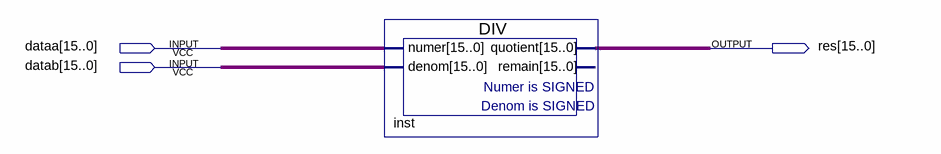
[diagram p0: schematic sheet]
// Quartus schematic Test_Div.bdf as structural Verilog: 1 symbols, 3 pins
module Test_Div (
  input  [15:0] dataa,
  input  [15:0] datab,
  output [15:0] res
);

  DIV inst (.numer(dataa), .denom(datab), .quotient(res));  // open: remain
endmodule
